# Altium schematic sheet [05] - FPGA PWR.SchDoc
size A3; DocumentNumber: 5; SheetNumber: 5; SheetTotal: 15
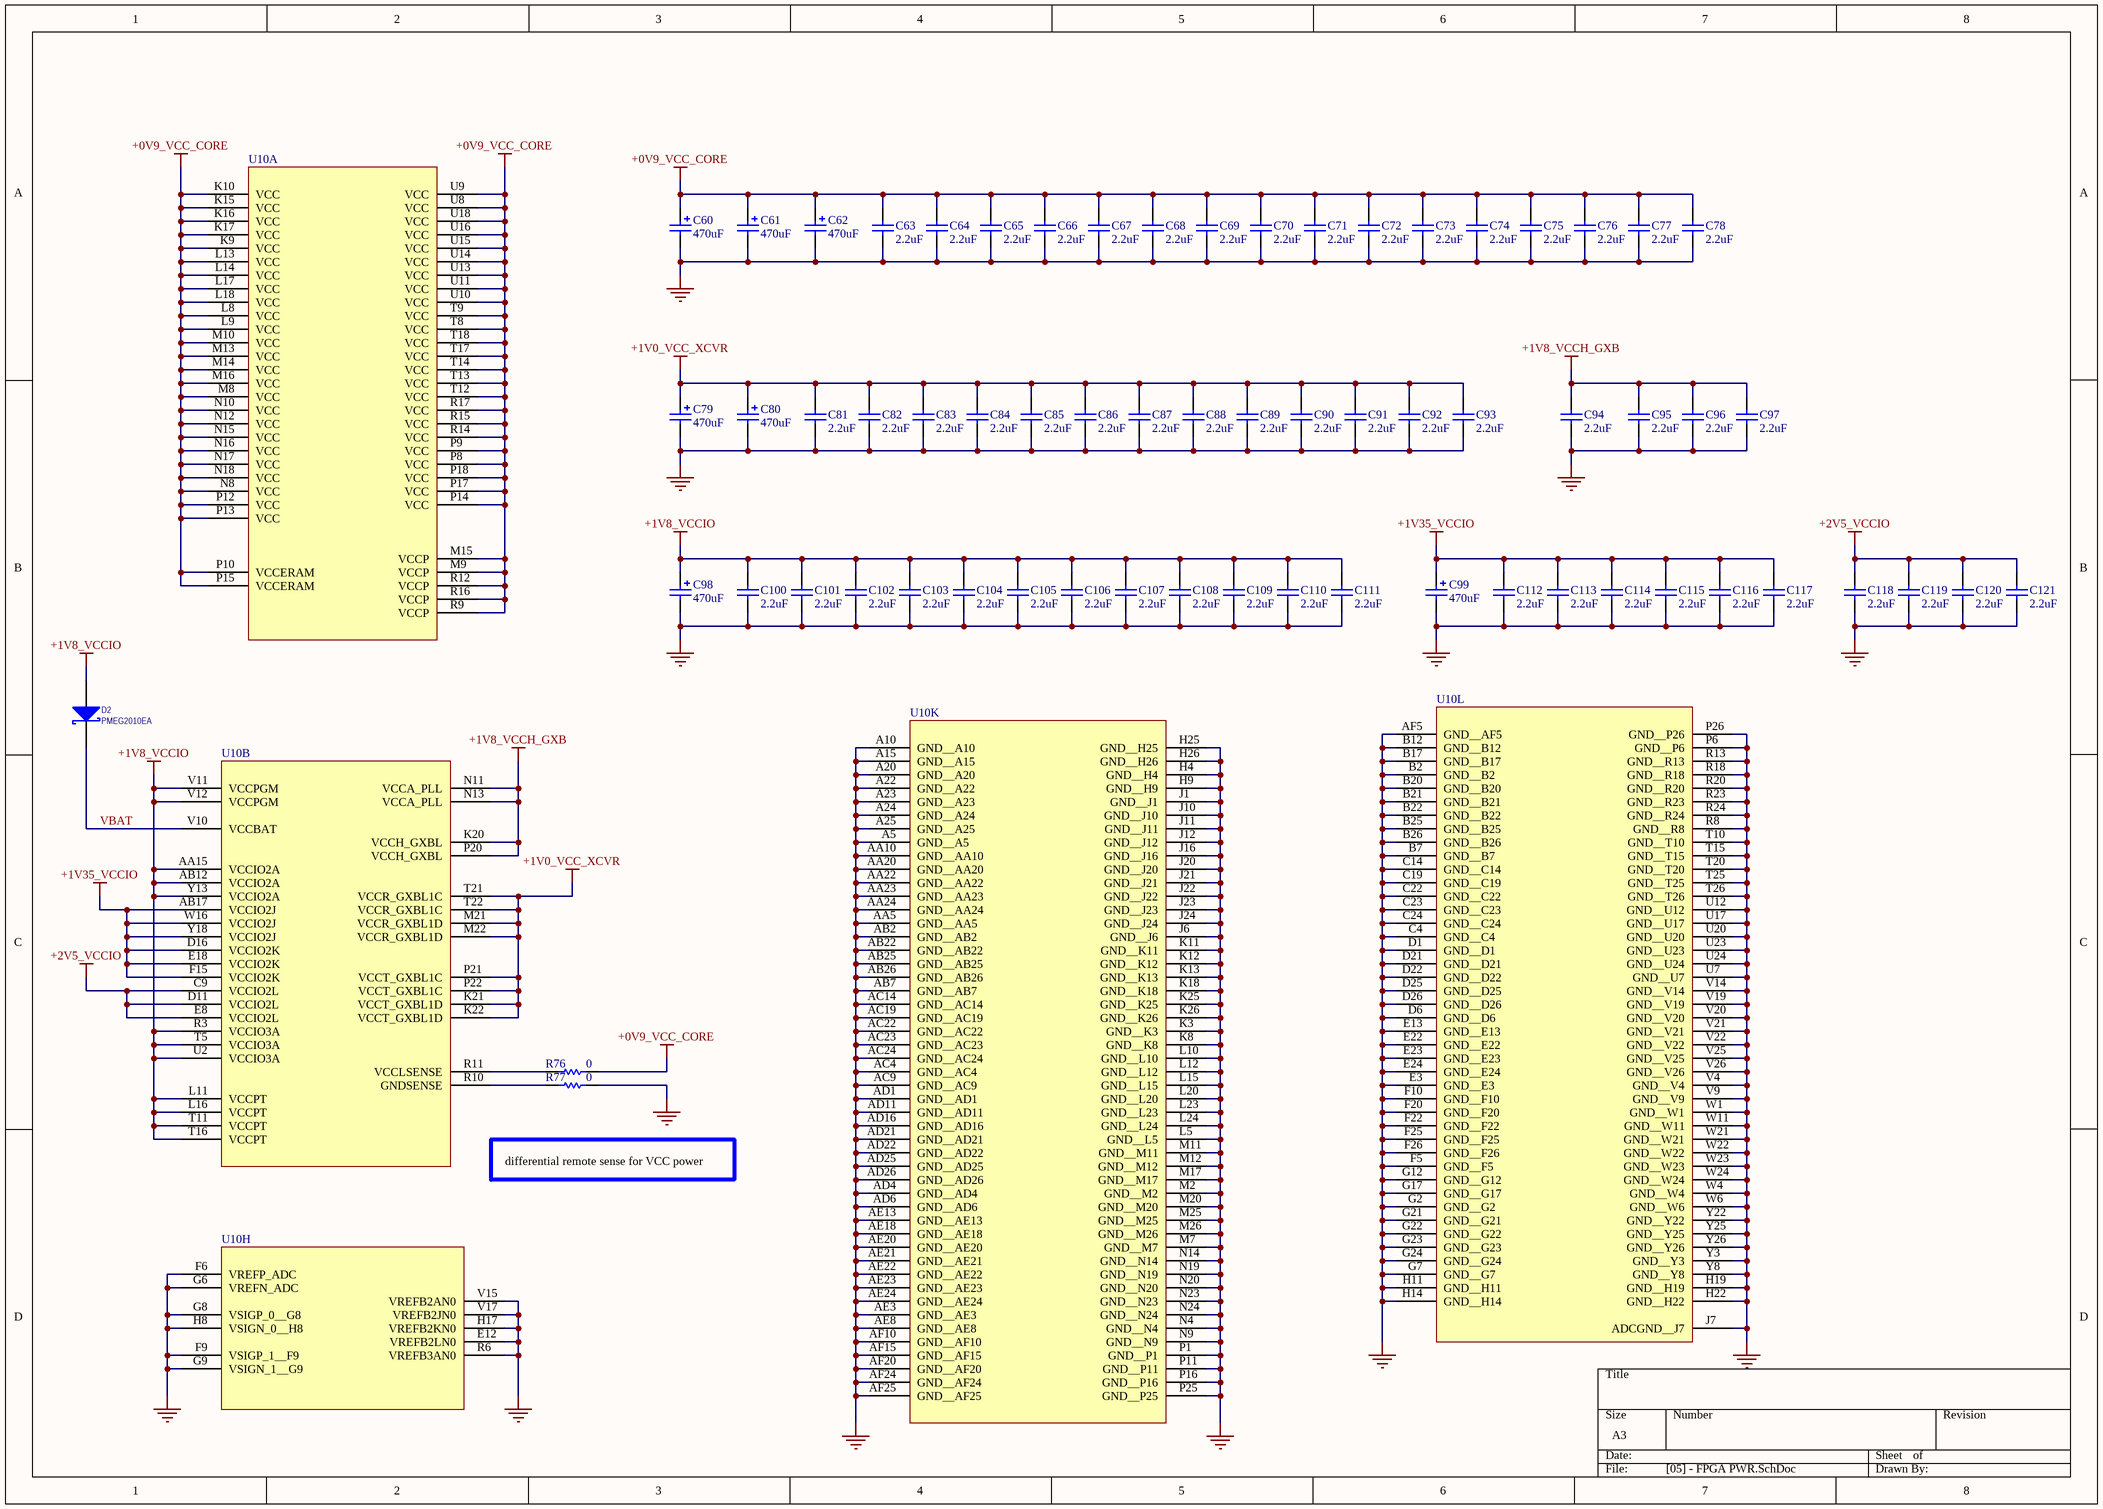
[diagram p0: [05] - FPGA PWR.SchDoc]

## Parts
C60  470uF  [TANT_D]
C61  470uF  [TANT_D]
C62  470uF  [TANT_D]
C63  2.2uF  [0402_C]
C64  2.2uF  [0402_C]
C65  2.2uF  [0402_C]
C66  2.2uF  [0402_C]
C67  2.2uF  [0402_C]
C68  2.2uF  [0402_C]
C69  2.2uF  [0402_C]
C70  2.2uF  [0402_C]
C71  2.2uF  [0402_C]
C72  2.2uF  [0402_C]
C73  2.2uF  [0402_C]
C74  2.2uF  [0402_C]
C75  2.2uF  [0402_C]
C76  2.2uF  [0402_C]
C77  2.2uF  [0402_C]
C78  2.2uF  [0402_C]
C79  470uF  [TANT_D]
C80  470uF  [TANT_D]
C81  2.2uF  [0402_C]
C82  2.2uF  [0402_C]
C83  2.2uF  [0402_C]
C84  2.2uF  [0402_C]
C85  2.2uF  [0402_C]
C86  2.2uF  [0402_C]
C87  2.2uF  [0402_C]
C88  2.2uF  [0402_C]
C89  2.2uF  [0402_C]
C90  2.2uF  [0402_C]
C91  2.2uF  [0402_C]
C92  2.2uF  [0402_C]
C93  2.2uF  [0402_C]
C94  2.2uF  [0402_C]
C95  2.2uF  [0402_C]
C96  2.2uF  [0402_C]
C97  2.2uF  [0402_C]
C98  470uF  [TANT_D]
C99  470uF  [TANT_D]
C100  2.2uF  [0402_C]
C101  2.2uF  [0402_C]
C102  2.2uF  [0402_C]
C103  2.2uF  [0402_C]
C104  2.2uF  [0402_C]
C105  2.2uF  [0402_C]
C106  2.2uF  [0402_C]
C107  2.2uF  [0402_C]
C108  2.2uF  [0402_C]
C109  2.2uF  [0402_C]
C110  2.2uF  [0402_C]
C111  2.2uF  [0402_C]
C112  2.2uF  [0402_C]
C113  2.2uF  [0402_C]
C114  2.2uF  [0402_C]
C115  2.2uF  [0402_C]
C116  2.2uF  [0402_C]
C117  2.2uF  [0402_C]
C118  2.2uF  [0402_C]
C119  2.2uF  [0402_C]
C120  2.2uF  [0402_C]
C121  2.2uF  [0402_C]
D2  PMEG2010EA  [SMA]
R76  0  [0402_R]
R77  0  [0402_R]
U10  10AX016 F27  [FBGA672]  (value not drawn)  (parts A,B,H,K,L of 12)

## Nets
+0V9_VCC_CORE: C60.1 C61.1 C62.1 C63.2 C64.2 C65.2 C66.2 C67.2 C68.2 C69.2 C70.2 C71.2 C72.2 C73.2 C74.2 C75.2 C76.2 C77.2 C78.2 R76.2 U10.K9(VCC) U10.K10(VCC) U10.K15(VCC) U10.K16(VCC) U10.K17(VCC) U10.L8(VCC) U10.L9(VCC) U10.L13(VCC) U10.L14(VCC) U10.L17(VCC) U10.L18(VCC) U10.M8(VCC) U10.M9(VCCP) U10.M10(VCC) U10.M13(VCC) U10.M14(VCC) U10.M15(VCCP) U10.M16(VCC) U10.N8(VCC) U10.N10(VCC) U10.N12(VCC) U10.N15(VCC) U10.N16(VCC) U10.N17(VCC) U10.N18(VCC) U10.P8(VCC) U10.P9(VCC) U10.P10(VCCERAM) U10.P12(VCC) U10.P13(VCC) U10.P14(VCC) U10.P15(VCCERAM) U10.P17(VCC) U10.P18(VCC) U10.R9(VCCP) U10.R12(VCCP) U10.R14(VCC) U10.R15(VCC) U10.R16(VCCP) U10.R17(VCC) U10.T8(VCC) U10.T9(VCC) U10.T12(VCC) U10.T13(VCC) U10.T14(VCC) U10.T17(VCC) U10.T18(VCC) U10.U8(VCC) U10.U9(VCC) U10.U10(VCC) U10.U11(VCC) U10.U13(VCC) U10.U14(VCC) U10.U15(VCC) U10.U16(VCC) U10.U18(VCC)
+1V0_VCC_XCVR: C79.1 C80.1 C81.2 C82.2 C83.2 C84.2 C85.2 C86.2 C87.2 C88.2 C89.2 C90.2 C91.2 C92.2 C93.2 U10.K21(VCCT_GXBL1D) U10.K22(VCCT_GXBL1D) U10.M21(VCCR_GXBL1D) U10.M22(VCCR_GXBL1D) U10.P21(VCCT_GXBL1C) U10.P22(VCCT_GXBL1C) U10.T21(VCCR_GXBL1C) U10.T22(VCCR_GXBL1C)
+1V8_VCCH_GXB: C94.2 C95.2 C96.2 C97.2 U10.K20(VCCH_GXBL) U10.N11(VCCA_PLL) U10.N13(VCCA_PLL) U10.P20(VCCH_GXBL)
+1V8_VCCIO: C98.1 C100.2 C101.2 C102.2 C103.2 C104.2 C105.2 C106.2 C107.2 C108.2 C109.2 C110.2 C111.2 D2.1(A) U10.AA15(VCCIO2A) U10.AB12(VCCIO2A) U10.L11(VCCPT) U10.L16(VCCPT) U10.R3(VCCIO3A) U10.T5(VCCIO3A) U10.T11(VCCPT) U10.T16(VCCPT) U10.U2(VCCIO3A) U10.V11(VCCPGM) U10.V12(VCCPGM) U10.Y13(VCCIO2A)
+1V35_VCCIO: C99.1 C112.2 C113.2 C114.2 C115.2 C116.2 C117.2 U10.AB17(VCCIO2J) U10.D16(VCCIO2K) U10.E18(VCCIO2K) U10.F15(VCCIO2K) U10.W16(VCCIO2J) U10.Y18(VCCIO2J)
+2V5_VCCIO: C118.2 C119.2 C120.2 C121.2 U10.C9(VCCIO2L) U10.D11(VCCIO2L) U10.E8(VCCIO2L)
GND: C60.2 C61.2 C62.2 C63.1 C64.1 C65.1 C66.1 C67.1 C68.1 C69.1 C70.1 C71.1 C72.1 C73.1 C74.1 C75.1 C76.1 C77.1 C78.1 C79.2 C80.2 C81.1 C82.1 C83.1 C84.1 C85.1 C86.1 C87.1 C88.1 C89.1 C90.1 C91.1 C92.1 C93.1 C94.1 C95.1 C96.1 C97.1 C98.2 C99.2 C100.1 C101.1 C102.1 C103.1 C104.1 C105.1 C106.1 C107.1 C108.1 C109.1 C110.1 C111.1 C112.1 C113.1 C114.1 C115.1 C116.1 C117.1 C118.1 C119.1 C120.1 C121.1 R77.2 U10.A5(GND__A5) U10.A10(GND__A10) U10.A15(GND__A15) U10.A20(GND__A20) U10.A22(GND__A22) U10.A23(GND__A23) U10.A24(GND__A24) U10.A25(GND__A25) U10.AA5(GND__AA5) U10.AA10(GND__AA10) U10.AA20(GND__AA20) U10.AA22(GND__AA22) U10.AA23(GND__AA23) U10.AA24(GND__AA24) U10.AB2(GND__AB2) U10.AB7(GND__AB7) U10.AB22(GND__AB22) U10.AB25(GND__AB25) U10.AB26(GND__AB26) U10.AC4(GND__AC4) U10.AC9(GND__AC9) U10.AC14(GND__AC14) U10.AC19(GND__AC19) U10.AC22(GND__AC22) U10.AC23(GND__AC23) U10.AC24(GND__AC24) U10.AD1(GND__AD1) U10.AD4(GND__AD4) U10.AD6(GND__AD6) U10.AD11(GND__AD11) U10.AD16(GND__AD16) U10.AD21(GND__AD21) U10.AD22(GND__AD22) U10.AD25(GND__AD25) U10.AD26(GND__AD26) U10.AE3(GND__AE3) U10.AE8(GND__AE8) U10.AE13(GND__AE13) U10.AE18(GND__AE18) U10.AE20(GND__AE20) U10.AE21(GND__AE21) U10.AE22(GND__AE22) U10.AE23(GND__AE23) U10.AE24(GND__AE24) U10.AF5(GND__AF5) U10.AF10(GND__AF10) U10.AF15(GND__AF15) U10.AF20(GND__AF20) U10.AF24(GND__AF24) U10.AF25(GND__AF25) U10.B2(GND__B2) U10.B7(GND__B7) U10.B12(GND__B12) U10.B17(GND__B17) U10.B20(GND__B20) U10.B21(GND__B21) U10.B22(GND__B22) U10.B25(GND__B25) U10.B26(GND__B26) U10.C4(GND__C4) U10.C14(GND__C14) U10.C19(GND__C19) U10.C22(GND__C22) U10.C23(GND__C23) U10.C24(GND__C24) U10.D1(GND__D1) U10.D6(GND__D6) U10.D21(GND__D21) U10.D22(GND__D22) U10.D25(GND__D25) U10.D26(GND__D26) U10.E3(GND__E3) U10.E12(VREFB2LN0) U10.E13(GND__E13) U10.E22(GND__E22) U10.E23(GND__E23) U10.E24(GND__E24) U10.F5(GND__F5) U10.F6(VREFP_ADC) U10.F9(VSIGP_1__F9) U10.F10(GND__F10) U10.F20(GND__F20) U10.F22(GND__F22) U10.F25(GND__F25) U10.F26(GND__F26) U10.G2(GND__G2) U10.G6(VREFN_ADC) U10.G7(GND__G7) U10.G8(VSIGP_0__G8) U10.G9(VSIGN_1__G9) U10.G12(GND__G12) U10.G17(GND__G17) U10.G21(GND__G21) U10.G22(GND__G22) U10.G23(GND__G23) U10.G24(GND__G24) U10.H4(GND__H4) U10.H8(VSIGN_0__H8) U10.H9(GND__H9) U10.H11(GND__H11) U10.H14(GND__H14) U10.H17(VREFB2KN0) U10.H19(GND__H19) U10.H22(GND__H22) U10.H25(GND__H25) U10.H26(GND__H26) U10.J1(GND__J1) U10.J6(GND__J6) U10.J7(ADCGND__J7) U10.J10(GND__J10) U10.J11(GND__J11) U10.J12(GND__J12) U10.J16(GND__J16) U10.J20(GND__J20) U10.J21(GND__J21) U10.J22(GND__J22) U10.J23(GND__J23) U10.J24(GND__J24) U10.K3(GND__K3) U10.K8(GND__K8) U10.K11(GND__K11) U10.K12(GND__K12) U10.K13(GND__K13) U10.K18(GND__K18) U10.K25(GND__K25) U10.K26(GND__K26) U10.L5(GND__L5) U10.L10(GND__L10) U10.L12(GND__L12) U10.L15(GND__L15) U10.L20(GND__L20) U10.L23(GND__L23) U10.L24(GND__L24) U10.M2(GND__M2) U10.M7(GND__M7) U10.M11(GND__M11) U10.M12(GND__M12) U10.M17(GND__M17) U10.M20(GND__M20) U10.M25(GND__M25) U10.M26(GND__M26) U10.N4(GND__N4) U10.N9(GND__N9) U10.N14(GND__N14) U10.N19(GND__N19) U10.N20(GND__N20) U10.N23(GND__N23) U10.N24(GND__N24) U10.P1(GND__P1) U10.P6(GND__P6) U10.P11(GND__P11) U10.P16(GND__P16) U10.P25(GND__P25) U10.P26(GND__P26) U10.R6(VREFB3AN0) U10.R8(GND__R8) U10.R13(GND__R13) U10.R18(GND__R18) U10.R20(GND__R20) U10.R23(GND__R23) U10.R24(GND__R24) U10.T10(GND__T10) U10.T15(GND__T15) U10.T20(GND__T20) U10.T25(GND__T25) U10.T26(GND__T26) U10.U7(GND__U7) U10.U12(GND__U12) U10.U17(GND__U17) U10.U20(GND__U20) U10.U23(GND__U23) U10.U24(GND__U24) U10.V4(GND__V4) U10.V9(GND__V9) U10.V14(GND__V14) U10.V15(VREFB2AN0) U10.V17(VREFB2JN0) U10.V19(GND__V19) U10.V20(GND__V20) U10.V21(GND__V21) U10.V22(GND__V22) U10.V25(GND__V25) U10.V26(GND__V26) U10.W1(GND__W1) U10.W4(GND__W4) U10.W6(GND__W6) U10.W11(GND__W11) U10.W21(GND__W21) U10.W22(GND__W22) U10.W23(GND__W23) U10.W24(GND__W24) U10.Y3(GND__Y3) U10.Y8(GND__Y8) U10.Y22(GND__Y22) U10.Y25(GND__Y25) U10.Y26(GND__Y26)
VBAT: D2.2(K) U10.V10(VCCBAT)
NetR76_1: R76.1 U10.R11(VCCLSENSE)
NetR77_1: R77.1 U10.R10(GNDSENSE)

## Notes on the sheet
- differential remote sense for VCC power

## Library data of the parts
C60-C62 C79 C80 C98 C99 = Cap Tant: Tantalum Polarized Capacitor; Manufacturer Part Num: T520D477M006ATE025; RATED_VOLTAGE: 6.3V; Value: 470uF
C63-C78 C81-C97 C100-C121 = Cap SMD: Non-Pol SMD Capacitor; Manufacturer Part Num: GRM155Z71A225ME43D; RATED_VOLTAGE: 10V; Dielectric: X7R; Value: 2.2uF
D2 = Diode Schottky: Schottky Diode; Value: PMEG2010EA; Manufacturer Part Num: *
R76 R77 = Res SMD: SMD Resistor; Tolerance: 5%; Value: 0; Manufacturer Part Num: *
U10 = 10AX016: Manufacturer Part Num: 10AX016E4F27E3SG; Value: 10AX016 F27